# EAGLE schematic activeElectrode_adapter (EAGLE 9.5.1)
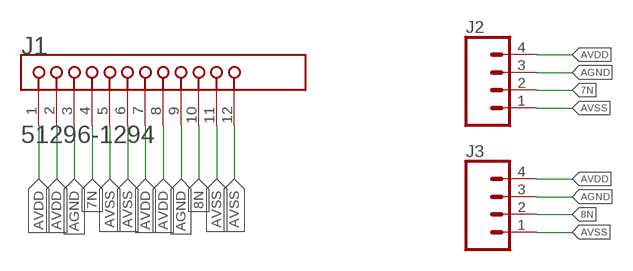
[diagram p0: schematic, sheet 1]

## Parts
J1  MOLEX_51296-1294_FLEX  [MOLEX_51296-1294_FLEX]
J2  CONN_04AE_4PIN  [AE-4-PTH]
J3  CONN_04AE_4PIN  [AE-4-PTH]

## Nets
7N: J1.4 J2.2
8N: J1.10 J3.2
AGND: J1.3 J1.9 J2.3 J3.3
AVDD: J1.1 J1.2 J1.7 J1.8 J2.4 J3.4
AVSS: J1.5 J1.6 J1.11 J1.12 J2.1 J3.1

## Library data of the parts
J1 = Molex - 51296-1294:MOLEX_51296-1294_FLEX: MOLX-51296-1294
J2 J3 = SparkFun-Connectors:CONN_04: Multi connection point. Often used as Generic Header-pin footprint for 0.1 inch spaced/style header connections On any of the 0.1 inch spaced packages, you can populate with these: Break Away Headers - Straight <https://www.sparkfun.com/products/116> (PRT-00116) Break Away Male Headers - Right Angle <https://www.sparkfun.com/products/553> (PRT-00553) Female Headers <https://www.sparkfun.com/products/115> (PRT-00115) Break Away Headers - Machine Pin <https://www.sparkfun.com/products/117> (PRT-00117) Break Away Female Headers - Swiss Machine Pin <https://www.sparkfun.com/products/743> (PRT-00743) For SCREWTERMINALS and SPRING TERMINALS visit here: Screw Terimnals on SparkFun.com <https://www.sparkfun.com/search/results?term=Screw+Terminals> (5mm/3.5mm/2.54mm spacing) This device is also useful as a general connection point to wire up your design to another part of your project. Our various solder wires solder well into these plated through hole pads. Hook-Up Wire - Assortment (Stranded, 22 AWG) <https://www.sparkfun.com/products/11375> (PRT-11375) Hook-Up Wire - Assortment (Solid Core, 22 AWG) <https://www.sparkfun.com/products/11367> (PRT-11367) View the entire wire category on our website here <https://www.sparkfun.com/categories/141> Special notes: Molex polarized connector foot print use with SKU : PRT-08231 with associated crimp pins and housings. 1MM SMD Version SKU: PRT-10208